# Altium schematic sheet Sitara_DDR_Old.SchDoc
size A3; SheetNumber: 12; SheetTotal: 12
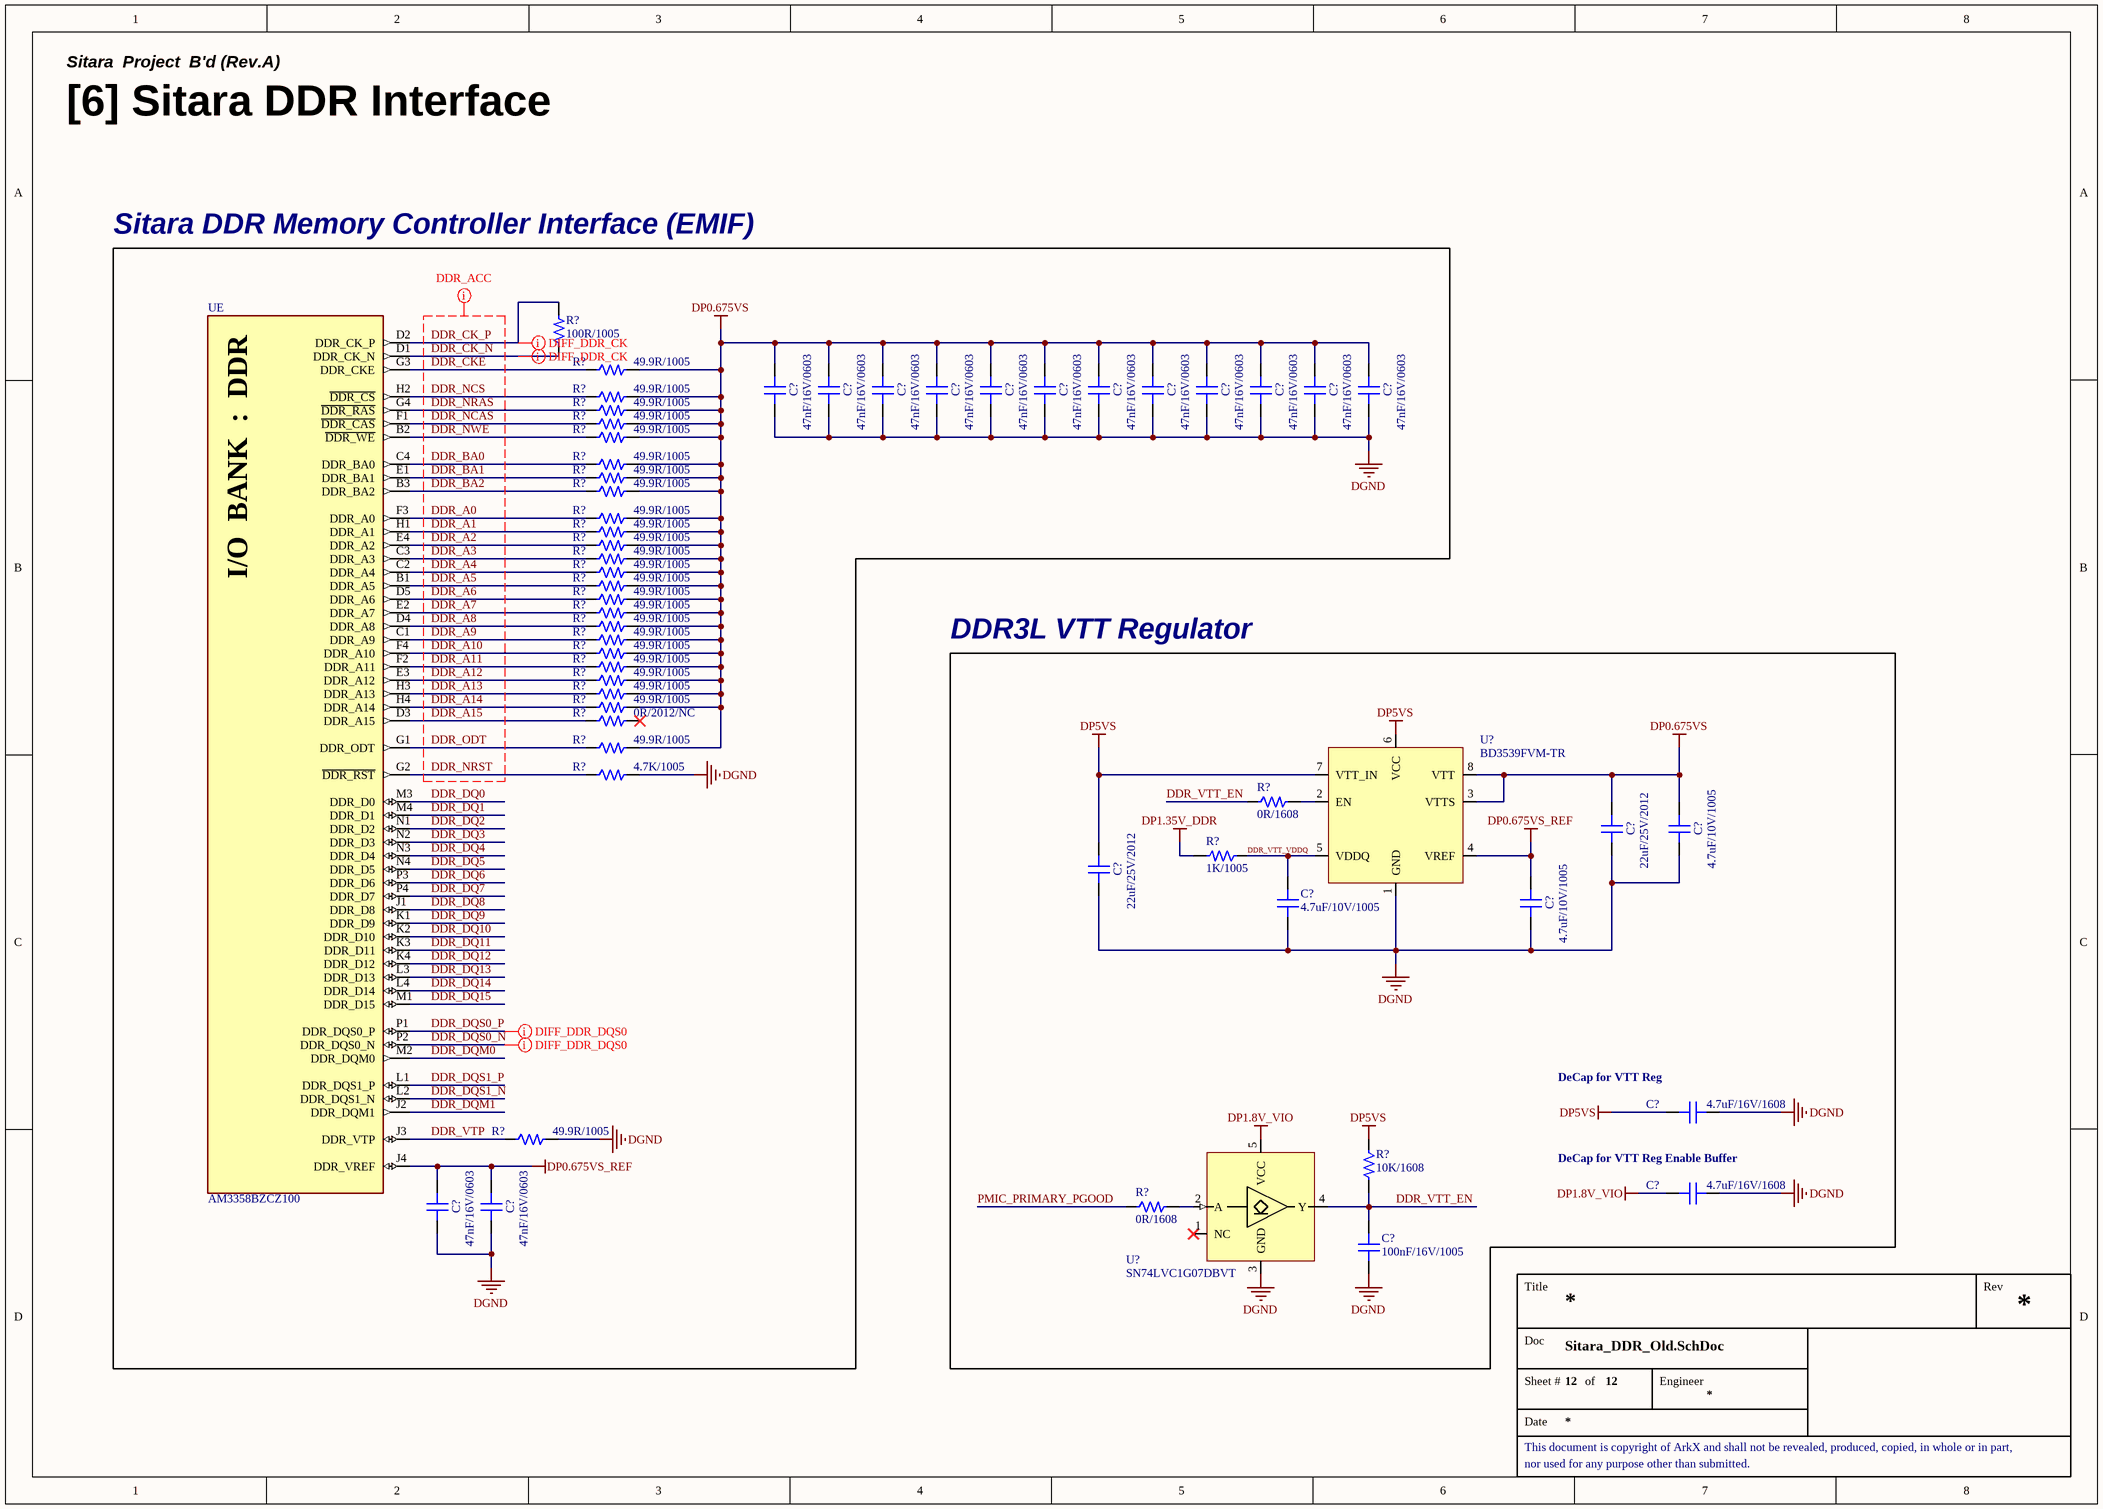
[diagram p0: Sitara_DDR_Old.SchDoc]

## Parts
(Parts that share a designator on the sheet are numbered #1, #2 ... from top to bottom, then left to right.)
C?#1  47nF/16V/0603  [CAP 0603 (0201_INCH)]
C?#2  47nF/16V/0603  [CAP 0603 (0201_INCH)]
C?#3  47nF/16V/0603  [CAP 0603 (0201_INCH)]
C?#4  47nF/16V/0603  [CAP 0603 (0201_INCH)]
C?#5  47nF/16V/0603  [CAP 0603 (0201_INCH)]
C?#6  47nF/16V/0603  [CAP 0603 (0201_INCH)]
C?#7  47nF/16V/0603  [CAP 0603 (0201_INCH)]
C?#8  47nF/16V/0603  [CAP 0603 (0201_INCH)]
C?#9  47nF/16V/0603  [CAP 0603 (0201_INCH)]
C?#10  47nF/16V/0603  [CAP 0603 (0201_INCH)]
C?#11  47nF/16V/0603  [CAP 0603 (0201_INCH)]
C?#12  47nF/16V/0603  [CAP 0603 (0201_INCH)]
C?#13  22uF/25V/2012  [CAP 2012 (0805_INCH)]
C?#14  4.7uF/10V/1005  [CAP 1005 (0402_INCH)]
C?#15  22uF/25V/2012  [CAP 2012 (0805_INCH)]
C?#16  4.7uF/10V/1005  [CAP 1005 (0402_INCH)]
C?#17  4.7uF/10V/1005  [CAP 1005 (0402_INCH)]
C?#18  4.7uF/16V/1608  [CAP 1608 (0603_INCH)]
C?#19  4.7uF/16V/1608  [CAP 1608 (0603_INCH)]
C?#20  47nF/16V/0603  [CAP 0603 (0201_INCH)]
C?#21  47nF/16V/0603  [CAP 0603 (0201_INCH)]
C?#22  100nF/16V/1005  [CAP 1005 (0402_INCH)]
R?#1  100R/1005  [RES 1005 (0402_inch)]
R?#2  49.9R/1005  [RES 1005 (0402_inch)]
R?#3  49.9R/1005  [RES 1005 (0402_inch)]
R?#4  49.9R/1005  [RES 1005 (0402_inch)]
R?#5  49.9R/1005  [RES 1005 (0402_inch)]
R?#6  49.9R/1005  [RES 1005 (0402_inch)]
R?#7  49.9R/1005  [RES 1005 (0402_inch)]
R?#8  49.9R/1005  [RES 1005 (0402_inch)]
R?#9  49.9R/1005  [RES 1005 (0402_inch)]
R?#10  49.9R/1005  [RES 1005 (0402_inch)]
R?#11  49.9R/1005  [RES 1005 (0402_inch)]
R?#12  49.9R/1005  [RES 1005 (0402_inch)]
R?#13  49.9R/1005  [RES 1005 (0402_inch)]
R?#14  49.9R/1005  [RES 1005 (0402_inch)]
R?#15  49.9R/1005  [RES 1005 (0402_inch)]
R?#16  49.9R/1005  [RES 1005 (0402_inch)]
R?#17  49.9R/1005  [RES 1005 (0402_inch)]
R?#18  49.9R/1005  [RES 1005 (0402_inch)]
R?#19  49.9R/1005  [RES 1005 (0402_inch)]
R?#20  49.9R/1005  [RES 1005 (0402_inch)]
R?#21  49.9R/1005  [RES 1005 (0402_inch)]
R?#22  49.9R/1005  [RES 1005 (0402_inch)]
R?#23  49.9R/1005  [RES 1005 (0402_inch)]
R?#24  49.9R/1005  [RES 1005 (0402_inch)]
R?#25  0R/2012/NC  [RES 2012 (0805_INCH)/NC]
R?#26  49.9R/1005  [RES 1005 (0402_inch)]
R?#27  4.7K/1005  [RES 1005 (0402_inch)]
R?#28  0R/1608  [RES 1608 (0603_inch)]
R?#29  1K/1005  [RES 1005 (0402_inch)]
R?#30  49.9R/1005  [RES 1005 (0402_inch)]
R?#31  10K/1608  [RES 1608 (0603_inch)]
R?#32  0R/1608  [RES 1608 (0603_inch)]
U  AM3358BZCZ100  [BGA324C80P18X18_1500X1500X140]  (part E of 8)
U?#1  BD3539FVM-TR  [IC_MSOP-8]
U?#2  SN74LVC1G07DBVT  [SOT-23-5 (TI DBV PACKAGE)]

## Blocks framed on the sheet
Sitara DDR Memory Controller Interface (EMIF): C?#1-C?#12 C?#20 C?#21 R?#1-R?#27 R?#30 U
DDR3L VTT Regulator: C?#13-C?#19 C?#22 R?#28 R?#29 R?#31 R?#32 U?#1 U?#2

## Nets
DGND: C?#1.1 C?#2.1 C?#3.1 C?#4.1 C?#5.1 C?#6.1 C?#7.1 C?#8.1 C?#9.1 C?#10.1 C?#11.1 C?#12.1 C?#13.1 C?#14.1 C?#15.1 C?#16.1 C?#17.1 C?#18.2 C?#19.2 C?#20.1 C?#21.1 C?#22.1 R?#27.2 R?#30.2 U?#1.1(GND) U?#2.3(GND)
DP0.675VS: C?#1.2 C?#2.2 C?#3.2 C?#4.2 C?#5.2 C?#6.2 C?#7.2 C?#8.2 C?#9.2 C?#10.2 C?#11.2 C?#12.2 C?#13.2 C?#14.2 R?#2.2 R?#3.2 R?#4.2 R?#5.2 R?#6.2 R?#7.2 R?#8.2 R?#9.2 R?#10.2 R?#11.2 R?#12.2 R?#13.2 R?#14.2 R?#15.2 R?#16.2 R?#17.2 R?#18.2 R?#19.2 R?#20.2 R?#21.2 R?#22.2 R?#23.2 R?#24.2 R?#26.2 U?#1.3(VTTS) U?#1.8(VTT)
DP0.675VS_REF: C?#17.2 C?#20.2 C?#21.2 U.J4(DDR_VREF) U?#1.4(VREF)
DP1.8V_VIO: C?#19.1 U?#2.5(VCC)
DP1.35V_DDR: R?#29.2
DP5VS: C?#15.2 C?#18.1 R?#31.1 U?#1.6(VCC) U?#1.7(VTT_IN)
DDR_A0: R?#10.1 U.F3(DDR_A0)
DDR_A1: R?#11.1 U.H1(DDR_A1)
DDR_A2: R?#12.1 U.E4(DDR_A2)
DDR_A3: R?#13.1 U.C3(DDR_A3)
DDR_A4: R?#14.1 U.C2(DDR_A4)
DDR_A5: R?#15.1 U.B1(DDR_A5)
DDR_A6: R?#16.1 U.D5(DDR_A6)
DDR_A7: R?#17.1 U.E2(DDR_A7)
DDR_A8: R?#18.1 U.D4(DDR_A8)
DDR_A9: R?#19.1 U.C1(DDR_A9)
DDR_A10: R?#20.1 U.F4(DDR_A10)
DDR_A11: R?#21.1 U.F2(DDR_A11)
DDR_A12: R?#22.1 U.E3(DDR_A12)
DDR_A13: R?#23.1 U.H3(DDR_A13)
DDR_A14: R?#24.1 U.H4(DDR_A14)
DDR_A15: R?#25.1 U.D3(DDR_A15)
DDR_BA0: R?#7.1 U.C4(DDR_BA0)
DDR_BA1: R?#8.1 U.E1(DDR_BA1)
DDR_BA2: R?#9.1 U.B3(DDR_BA2)
DDR_CK_N: R?#1.1 U.D1(DDR_CK_N)
DDR_CK_P: R?#1.2 U.D2(DDR_CK_P)
DDR_CKE: R?#2.1 U.G3(DDR_CKE)
DDR_DQ0: U.M3(DDR_D0)
DDR_DQ1: U.M4(DDR_D1)
DDR_DQ2: U.N1(DDR_D2)
DDR_DQ3: U.N2(DDR_D3)
DDR_DQ4: U.N3(DDR_D4)
DDR_DQ5: U.N4(DDR_D5)
DDR_DQ6: U.P3(DDR_D6)
DDR_DQ7: U.P4(DDR_D7)
DDR_DQ8: U.J1(DDR_D8)
DDR_DQ9: U.K1(DDR_D9)
DDR_DQ10: U.K2(DDR_D10)
DDR_DQ11: U.K3(DDR_D11)
DDR_DQ12: U.K4(DDR_D12)
DDR_DQ13: U.L3(DDR_D13)
DDR_DQ14: U.L4(DDR_D14)
DDR_DQ15: U.M1(DDR_D15)
DDR_DQM0: U.M2(DDR_DQM0)
DDR_DQM1: U.J2(DDR_DQM1)
DDR_DQS0_N: U.P2(DDR_DQS0_N)
DDR_DQS0_P: U.P1(DDR_DQS0_P)
DDR_DQS1_N: U.L2(DDR_DQS1_N)
DDR_DQS1_P: U.L1(DDR_DQS1_P)
DDR_NCAS: R?#5.1 U.F1(~{DDR_CAS})
DDR_NCS: R?#3.1 U.H2(~{DDR_CS})
DDR_NRAS: R?#4.1 U.G4(~{DDR_RAS})
DDR_NRST: R?#27.1 U.G2(~{DDR_RST})
DDR_NWE: R?#6.1 U.B2(~{DDR_WE})
DDR_ODT: R?#26.1 U.G1(DDR_ODT)
DDR_VTP: R?#30.1 U.J3(DDR_VTP)
DDR_VTT_EN: C?#22.2 R?#28.1 R?#31.2 U?#2.4(Y)
DDR_VTT_VDDQ: C?#16.2 R?#29.1 U?#1.5(VDDQ)
PMIC_PRIMARY_PGOOD: R?#32.1
NetR?#28_2: R?#28.2 U?#1.2(EN)
NetR?#32_2: R?#32.2 U?#2.2(A)

Not connected (* = marked no-connect by the designer): R?#25 2*; U?#2 1(NC)*

## Layout directives
rule Matched Net Lengths [Delay Tolerance = 10ps]; net class DDR_ACC: DDR_A0, DDR_A1, DDR_A2, DDR_A3, DDR_A4, DDR_A5, DDR_A6, DDR_A7, DDR_A8, DDR_A9, DDR_A10, DDR_A11, DDR_A12, DDR_A13, DDR_A14, DDR_A15, DDR_BA0, DDR_BA1, DDR_BA2, DDR_CK_N, DDR_CK_P, DDR_CKE, DDR_NCAS, DDR_NCS, DDR_NRAS, DDR_NRST, DDR_NWE, DDR_ODT
differential pair; differential pair class DIFF_DDR_CK: DDR_CK_N, DDR_CK_P
differential pair; differential pair class DIFF_DDR_DQS0: DDR_DQS0_N, DDR_DQS0_P

## Notes on the sheet
- Sitara  Project  B'd (Rev.A)
- [6] Sitara DDR Interface
- (near C?#18) DeCap for VTT Reg
- (near C?#19) DeCap for VTT Reg Enable Buffer
- Title
- Rev
- Doc
- Sheet #
- of
- Engineer
- This document is copyright of ArkX and shall not be revealed, produced, copied, in whole or in part,
- Date
- nor used for any purpose other than submitted.
- (in symbol IC_SOC_AM3358BZCZ100, part E) I/O  BANK  :  DDR

## Library data of the parts
C?#1-C?#12 C?#20 C?#21 = CAP_47nF/16V/0603: 16V 47nF X5R ±10% 0201 Multilayer Ceramic Capacitors MLCC - SMD/SMT ROHS; JLCPCB Part Type: Extended Part; LCSC Part #: C88917
C?#13 C?#15 = CAP_22uF/25V/2012: Ceramic CAP_22uF/25V/2012; LCSC Part #: C45783; JLCPCB Part Type: Basic Part
C?#14 C?#16 C?#17 = CAP_4.7uF/10V/1005: 10V 4.7uF X5R ±20% 0402  Multilayer Ceramic Capacitors MLCC - SMD/SMT ROHS; JLCPCB Part Type: Basic Part; LCSC Part #: C23733
C?#18 C?#19 = CAP_4.7uF/16V/1608: Ceramic CAP_4.7uF/16V/1608; LCSC Part #: C19666; JLCPCB Part Type: Basic Part
C?#22 = CAP_100nF/16V/1005: Ceramic CAP_100nF/16V/1005; LCSC Part #: C1525; JLCPCB Part Type: Basic Part
R?#1 = RES_100R/1005/62.5mW: Value: 100R; Power Rating: 62.5mW; Precision: 1%; Size: 1005; LCSC Part #: C25076; JLCPCB Part Type: Basic Part
R?#2-R?#24 R?#26 R?#30 = RES_49.9R/1005/62.5mW: Value: 49.9R; Power Rating: 62.5mW; Precision: 1%; Size: 1005; LCSC Part #: C25120; JLCPCB Part Type: Basic Part
R?#25 = RES_NC_0R/2012/0.125W: 0R/2012/0.125W/NC; Value: 0R; Power Rating: 0.1W; Precision: 1%; Size: 1608
R?#27 = RES_4.7K/1005/62.5mW: Value: 4.7K; Power Rating: 62.5mW; Precision: 1%; Size: 1005; LCSC Part #: C25900; JLCPCB Part Type: Basic Part
R?#28 R?#32 = RES_0R/1608/0.1W: Value: 0R; Power Rating: 0.1W; Precision: 1%; Size: 1608; LCSC Part #: C21189; JLCPCB Part Type: Basic Part
R?#29 = RES_1K/1005/62.5mW: Value: 1K; Power Rating: 62.5mW; Precision: 1%; Size: 1005; LCSC Part #: C11702; JLCPCB Part Type: Basic Part
R?#31 = RES_10K/1608/0.1W: Value: 10K; Power Rating: 0.1W; Precision: 1%; Size: 1608; LCSC Part #: C25804; JLCPCB Part Type: Basic Part
U = IC_SOC_AM3358BZCZ100: ARM® Cortex®-A8 Microprocessor IC Sitara™ 1 Core, 32-Bit 1.0GHz 324-NFBGA (15x15); LCSC Part #: C73932; JLCPCB Part Type: Extended Part
U?#1 = IC_REG_VTT_BD3539FVM-TR: 1.0V to 5.5V, 1A 1ch / Termination Regulators for DDR-SDRAMs, 8-MSOP; LCSC Part #: C213437; JLCPCB Part Type: Extended Part
U?#2 = IC_BUF_SN74LVC1G07DBVT: Single Buffer/Driver With Open-Drain Output / IC BUF NON-INVERT 5.5V SOT23-5; LCSC Part #: C2867373; JLCPCB Part Type: Extended Part